# Altium schematic sheet Ampli_ancha.SchDoc
size A4
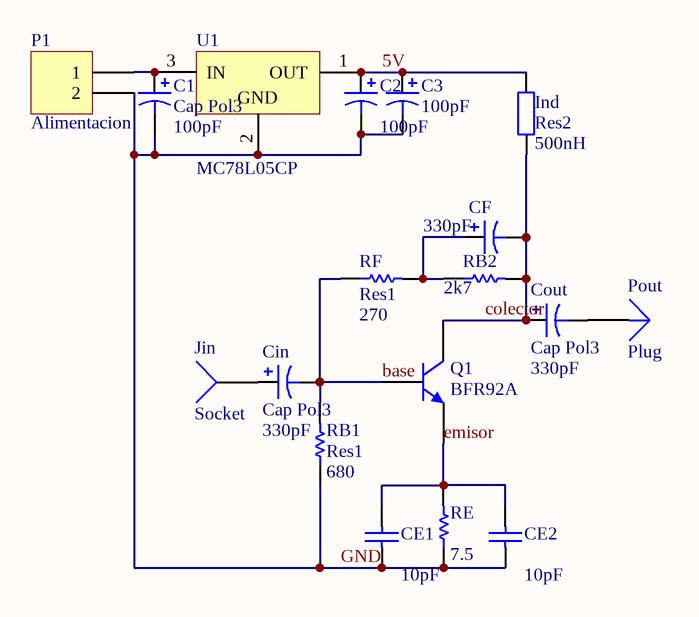
[diagram p0: Ampli_ancha.SchDoc]

## Parts
C1  Cap Pol3  value 100pF  [C0805]
C2  value 100pF  [C0805]  (hidden comment: Cap Pol3)
C3  value 100pF  [C0805]  (hidden comment: Cap Pol3)
CE1  value 10pF  [1608[0603]]  (hidden comment: Cap Semi)
CE2  value 10pF  [1608[0603]]  (hidden comment: Cap Semi)
CF  value 330pF  [C0805]  (hidden comment: Cap Pol3)
Cin  Cap Pol3  value 330pF  [C0805]
Cout  Cap Pol3  value 330pF  [C0805]
Ind  Res2  value 500nH  [AXIAL-0.4]
Jin  Socket  [PIN1]
P1  Alimentacion  [HDR1X2]
Pout  Plug  [PIN1]
Q1  BFR92A  [SOT23]
RB1  Res1  value 680  [AXIAL-0.3]
RB2  value 2k7  [AXIAL-0.3]  (hidden comment: Res1)
RE  value 7.5  [2012[0805]]  (hidden comment: Res Semi)
RF  Res1  value 270  [AXIAL-0.3]
U1  MC78L05CP  [29-04]

## Nets
5V: C2.1 C3.1 Ind.2 U1.1(OUT)
base: Cin.2 Q1.1(B) RB1.2 RF.1
colector: CF.2 Cout.1 Ind.1 Q1.3(C) RB2.2
emisor: CE1.2 CE2.2 Q1.2(E) RE.2
GND: C1.2 C2.2 C3.2 CE1.1 CE2.1 P1.2 RB1.1 RE.1 U1.2(GND)
NetC1_1: C1.1 P1.1 U1.3(IN)
NetCF_1: CF.1 RB2.1 RF.2
NetCin_1: Cin.1 Jin.1
NetCout_2: Cout.2 Pout.1

## Library data of the parts
C1-C3 CF Cin Cout = Cap Pol3: Polarized Capacitor (Surface Mount); Published: 8-Jun-2000; LatestRevisionDate: 17-Jul-2002; LatestRevisionNote: Re-released for DXP Platform.; PackageReference: C0805; Publisher: Altium Limited
CE1 CE2 = Cap Semi: Capacitor (Semiconductor SIM Model); Published: 8-Jun-2000; LatestRevisionDate: 17-Jul-2002; LatestRevisionNote: Re-released for DXP Platform.; PackageReference: C1206; Publisher: Altium Limited
Ind = Res2: Resistor; Published: 8-Jun-2000; LatestRevisionDate: 17-Jul-2002; LatestRevisionNote: Re-released for DXP Platform.; PackageReference: AXIAL-0.4; Publisher: Altium Limited
P1 = Header 2: Header, 2-Pin; LatestRevisionDate: 17-Jul-2002; LatestRevisionNote: Re-released for DXP Platform.; Publisher: Altium Limited
Q1 = BFR92A: NPN 5 GHz Wideband Transistor; Published: 17-Sep-2003; DatasheetDocument: 29-Oct-1997; PackageDocument: May-1999; PackageReference: SOT23; Publisher: Altium Limited; ComponentLink1Description: Manufacturer Link; ComponentLink1URL: http://www.semiconductors.philips.com/; ComponentLink2Description: Datasheet; ComponentLink2URL: http://www.semiconductors.philips.com/acrobat/datasheets/BFR92A_2.pdf
RB1 RB2 RF = Res1: Resistor; Published: 8-Jun-2000; LatestRevisionDate: 17-Jul-2002; LatestRevisionNote: Re-released for DXP Platform.; PackageReference: AXIAL-0.3; Publisher: Altium Limited
RE = Res Semi: Semiconductor Resistor; Published: 8-Jun-2000; LatestRevisionDate: 17-Jul-2002; LatestRevisionNote: Re-released for DXP Platform.; PackageReference: AXIAL-0.5; Publisher: Altium Limited
U1 = MC78L05CP: 3-Terminal Low-Current Positive Fixed Voltage Regulator; PackageDocument: 1996; Published: 17-Jul-2002; DatasheetDocument: 1988; PackageReference: 29-04; Publisher: Altium Limited; ComponentLink1Description: Manufacturer Link; ComponentLink1URL: http://www.onsemi.com/site/products/taxonomy/0,4438,503,00.html; ComponentLink2Description: Datasheet; ComponentLink2URL: http://www.onsemi.com/pub/Collateral/MC78L00A-D.PDF
Jin = Socket: LatestRevisionDate: 17-Jul-2002; LatestRevisionNote: Re-released for DXP Platform.; Publisher: Altium Limited
Pout = Plug: LatestRevisionDate: 17-Jul-2002; LatestRevisionNote: Re-released for DXP Platform.; Publisher: Altium Limited